# Altium schematic sheet Voice.SCHDOC
size B; Organization: Altium Limited; Address1: L3, 12a Rodborough Rd; Address2: Frenchs Forest; Address3: NSW; Address4: Australia 2086; DocumentNumber: 2; SheetNumber: 2; SheetTotal: 9
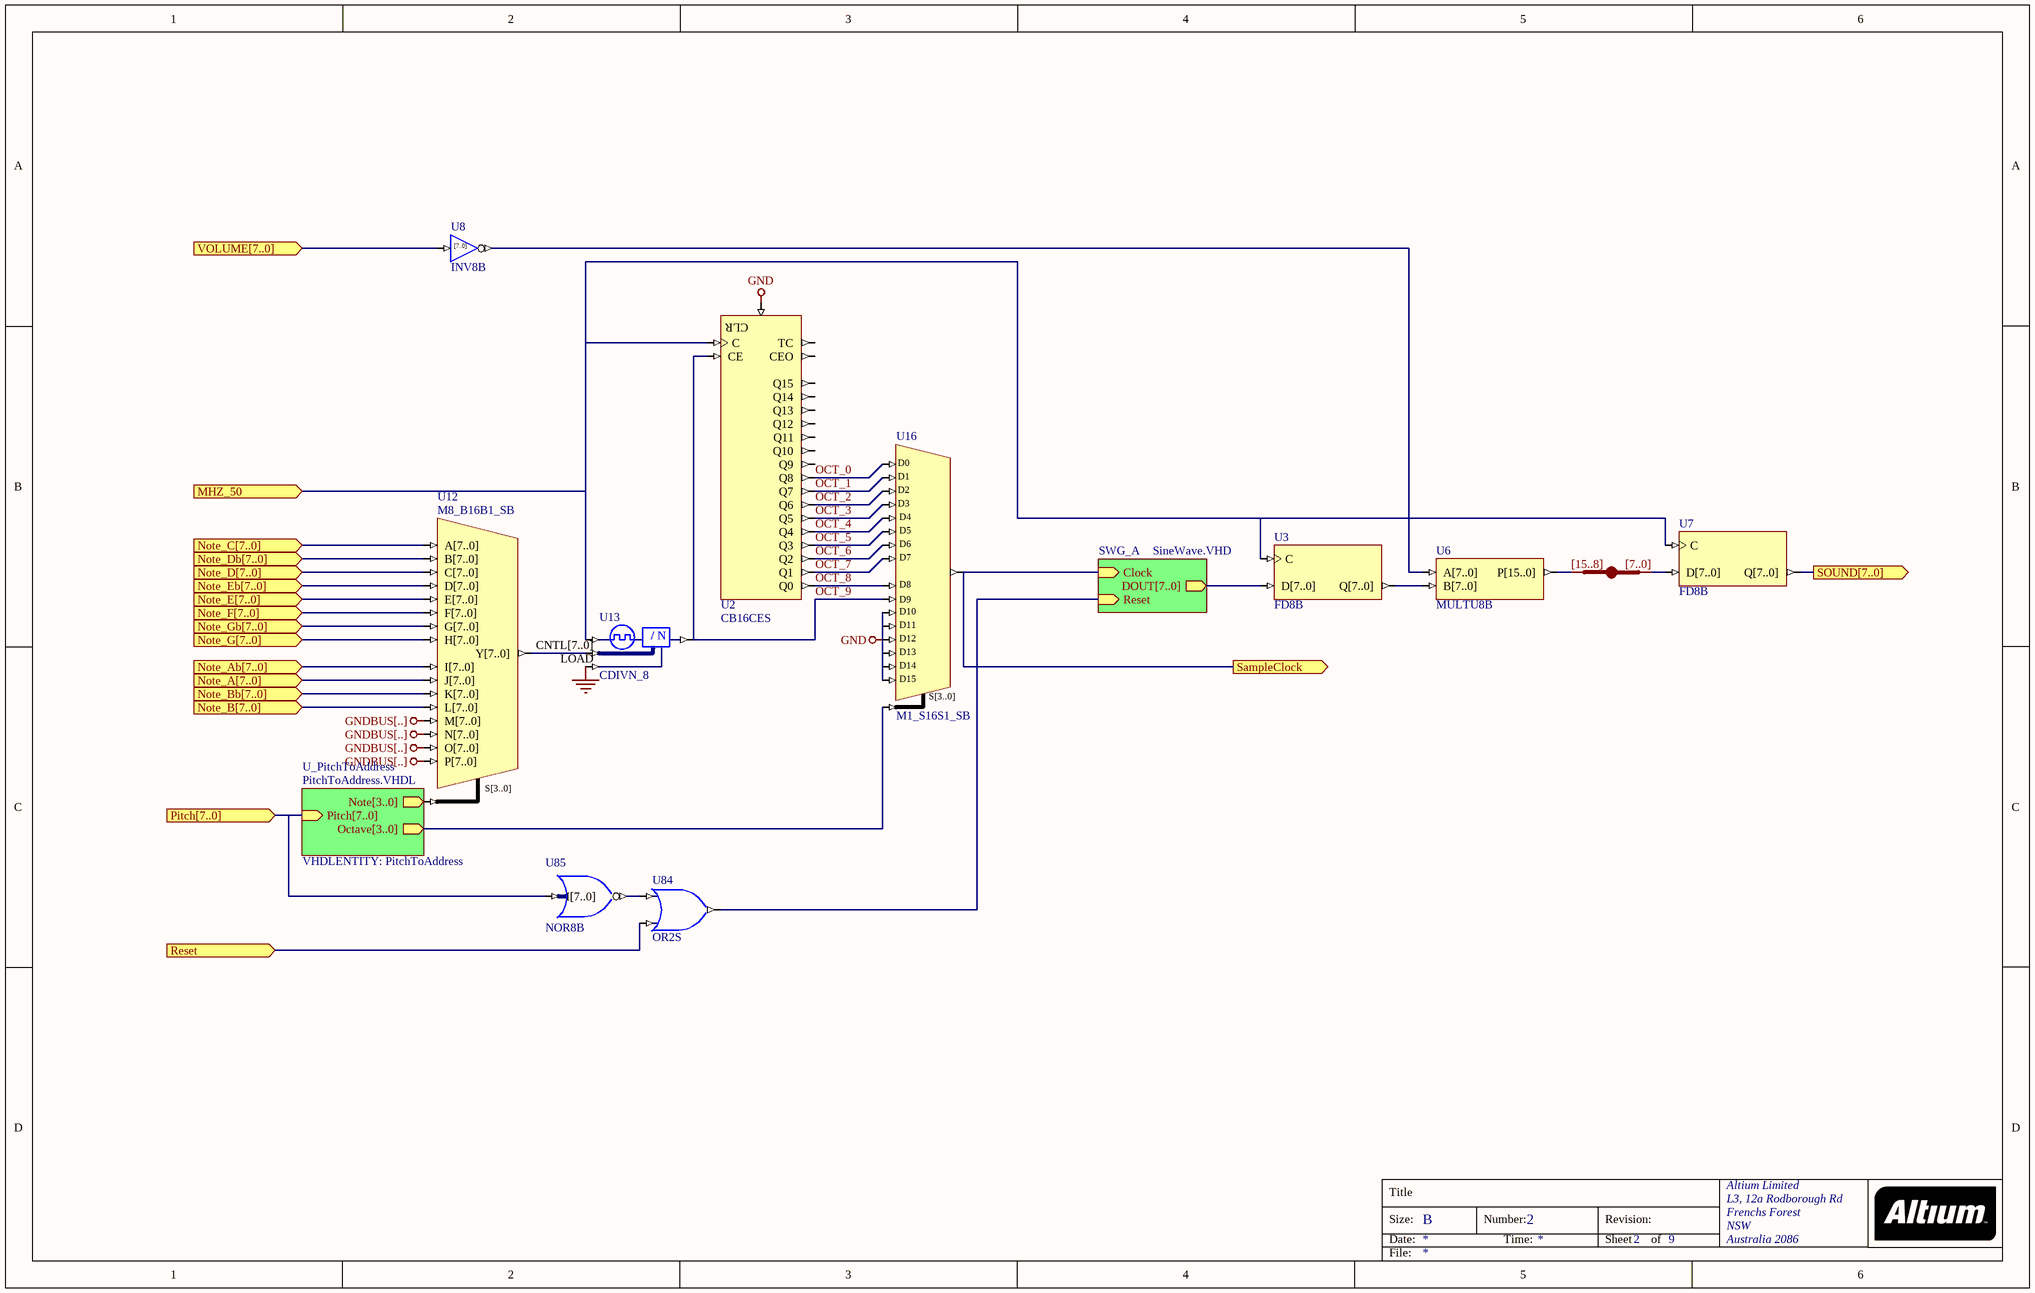
[diagram p0: Voice.SCHDOC]

## Parts
JB_AUTO?  IndexA: [15..8]  IndexB: [7..0]  (hidden comment: JB)
U2  CB16CES
U3  FD8B
U6  MULTU8B
U7  FD8B
U8  INV8B
U12  M8_B16B1_SB
U13  CDIVN_8
U16  M1_S16S1_SB
U84  OR2S
U85  NOR8B

## Sub-sheets
SWG_A = SineWave.VHD: Clock (in), DOUT[7..0] (out), Reset (in)  | VHDLENTITY: SineWaveGenerator
U_PitchToAddress = PitchToAddress.VHDL: Note[3..0] (out), Octave[3..0] (out), Pitch[7..0] (in)  | VHDLENTITY: PitchToAddress

## Ports
MHZ_50 (in), Note_A[7..0] (in), Note_Ab[7..0] (in), Note_B[7..0] (in), Note_Bb[7..0] (in), Note_C[7..0] (in), Note_D[7..0] (in), Note_Db[7..0] (in), Note_E[7..0] (in), Note_Eb[7..0] (in), Note_F[7..0] (in), Note_G[7..0] (in), Note_Gb[7..0] (in), Pitch[7..0] (in), Reset (in), SampleClock (out), SOUND[7..0] (out), VOLUME[7..0] (in)

## Nets
GND: U2.CLR U13.LOAD U16.D10 U16.D11 U16.D12 U16.D13 U16.D14 U16.D15
GNDBUS[..]: U12.M[7..0] U12.N[7..0] U12.O[7..0] U12.P[7..0]
MHZ_50: U2.C U3.C U7.C U13.CLKIN ; port MHZ_50
Note_A[7..0]: U12.J[7..0] ; port Note_A[7..0]
Note_Ab[7..0]: U12.I[7..0] ; port Note_Ab[7..0]
Note_B[7..0]: U12.L[7..0] ; port Note_B[7..0]
Note_Bb[7..0]: U12.K[7..0] ; port Note_Bb[7..0]
Note_C[7..0]: U12.A[7..0] ; port Note_C[7..0]
Note_D[7..0]: U12.C[7..0] ; port Note_D[7..0]
Note_Db[7..0]: U12.B[7..0] ; port Note_Db[7..0]
Note_E[7..0]: U12.E[7..0] ; port Note_E[7..0]
Note_Eb[7..0]: U12.D[7..0] ; port Note_Eb[7..0]
Note_F[7..0]: U12.F[7..0] ; port Note_F[7..0]
Note_G[7..0]: U12.H[7..0] ; port Note_G[7..0]
Note_Gb[7..0]: U12.G[7..0] ; port Note_Gb[7..0]
OCT_0: U2.Q8 U16.D0
OCT_1: U2.Q7 U16.D1
OCT_2: U2.Q6 U16.D2
OCT_3: U2.Q5 U16.D3
OCT_4: U2.Q4 U16.D4
OCT_5: U2.Q3 U16.D5
OCT_6: U2.Q2 U16.D6
OCT_7: U2.Q1 U16.D7
OCT_8: U2.Q0 U16.D8
OCT_9: U2.CE U13.CLKDV U16.D9
Pitch[7..0]: U85.I[7..0] ; port Pitch[7..0], sheet U_PitchToAddress/Pitch[7..0]
Reset: U84.I1 ; port Reset
SampleClock: U16.O ; port SampleClock, sheet SWG_A/Clock
SOUND[7..0]: U7.Q[7..0] ; port SOUND[7..0]
VOLUME[7..0]: U8.I[7..0] ; port VOLUME[7..0]
NetJB_AUTO?_A[0..0]: JB_AUTO?.A[0..0] U6.P[15..0]
NetJB_AUTO?_B[0..0]: JB_AUTO?.B[0..0] U7.D[7..0]
NetU3_D[7..0]: U3.D[7..0] ; sheet SWG_A/DOUT[7..0]
NetU3_Q[7..0]: U3.Q[7..0] U6.B[7..0]
NetU6_A[7..0]: U6.A[7..0] U8.O[7..0]
NetU12_S[3..0]: U12.S[3..0] ; sheet U_PitchToAddress/Note[3..0]
NetU12_Y[7..0]: U12.Y[7..0] U13.CNTL[7..0]
NetU16_S[3..0]: U16.S[3..0] ; sheet U_PitchToAddress/Octave[3..0]
NetU84_I0: U84.I0 U85.O
NetU84_O: U84.O ; sheet SWG_A/Reset

Not connected (* = marked no-connect by the designer): U2 CEO Q9 Q10 Q11 Q12 Q13 Q14 Q15 TC

## Buses and harness runs
bus port Pitch[7..0] = sheet U_PitchToAddress/Pitch[7..0]

## Notes on the sheet
- Title
- Size:
- Date:
- B
- Number:
- Time:
- Revision:
- Sheet
- of
- File:
- (in symbol CDIVN_8) / N
- (in symbol INV8B) [7..0]

## Library data of the parts
JB_AUTO? = JB: System BUS Joiner; ArchiveName: GENERIC; VHDLIB_SIM: GENERIC_LIB; Published: 29-Jan-2004; Publisher: Altium Limited; Core Revision: 1.00.00
U2 = CB16CES: 16-Bit Cascadable Binary Counters with Clock Enable and Asynchronous Clear, Single Pin Version; ArchiveName: GENERIC; VHDLIB_SIM: GENERIC_LIB; Published: 29-Jan-2004; Publisher: Altium Limited; Core Revision: 1.00.00
U3 U7 = FD8B: 8-Bit D-Type Flip-Flop, Bus Version; Xilinx Equivalent: FD8; ArchiveName: GENERIC; VHDLIB_SIM: GENERIC_LIB; Published: 29-Jan-2004; Publisher: Altium Limited; Core Revision: 1.00.00
U6 = MULTU8B: 8x8 Unsigned Multiplier, Bus Version; ArchiveName: GENERIC; VHDLIB_SIM: GENERIC_LIB; Published: 29-Jan-2004; Publisher: Altium Limited; Core Revision: 1.00.00
U8 = INV8B: 8-Bit Inverter, Bus Version; ArchiveName: GENERIC; VHDLIB_SIM: GENERIC_LIB; Published: 29-Jan-2004; Publisher: Altium Limited; Core Revision: 1.00.00
U12 = M8_B16B1_SB: 16x8-Bit Bus to 1x8-Bit Bus Multiplexer With Bus Version Select; ArchiveName: GENERIC; VHDLIB_SIM: GENERIC_LIB; Published: 29-Jan-2004; Publisher: Altium Limited; Core Revision: 1.00.00
U13 = CDIVN_8: 8-Bit Programmable Clock Divider; ArchiveName: GENERIC; Published: 18-Dec-2003; Publisher: Altium Limited; Core Revision: 1.00.00
U16 = M1_S16S1_SB: 16x1-Single Wire to 1x1-Single Wire Multiplexer With Bus Version Select; ArchiveName: GENERIC; VHDLIB_SIM: GENERIC_LIB; Published: 29-Jan-2004; Publisher: Altium Limited; Core Revision: 1.00.00
U84 = OR2S: 2-Input OR Gate, Single Pin Version; Xilinx Equivalent: OR2; ArchiveName: GENERIC; Published: 18-Dec-2003; Publisher: Altium Limited; Core Revision: 1.00.00
U85 = NOR8B: 8-Input NOR Gate, Bus Version; ArchiveName: GENERIC; Published: 18-Dec-2003; Publisher: Altium Limited; Core Revision: 1.00.00